# Altium project E17-07-TIU.PrjPcb
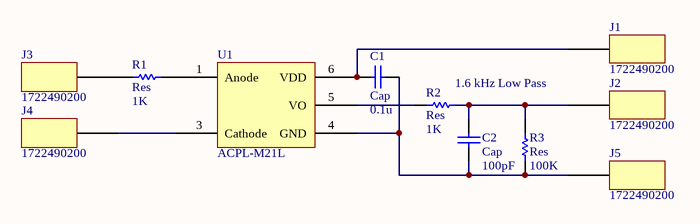
[diagram p0: E17-07-TIU.SchDoc]
1 sheet, 11 parts. Net scope: global (net labels, ports and power ports of the same name join across sheets).
Board file: E17-07-TIU.PcbDoc

## Sheet E17-07-TIU.SchDoc
size A4

### Parts
C1  Cap  value 0.1u  [C0805]
C2  Cap  value 100pF  [C0805]
J1  1722490200  [1722490200]
J2  1722490200  [1722490200]
J3  1722490200  [1722490200]
J4  1722490200  [1722490200]
J5  1722490200  [1722490200]
R1  Res  value 1K  [2012[0805]]
R2  Res  value 1K  [2012[0805]]
R3  Res  value 100K  [2012[0805]]
U1  ACPL-M21L  [ACPL-M21L]

### Nets
NetC1_1: C1.1 C2.1 J5.1 R3.1 U1.4(GND)
NetC1_2: C1.2 J1.1 U1.6(VDD)
NetC2_2: C2.2 J2.1 R2.2 R3.2
NetJ3_1: J3.1 R1.1
NetJ4_1: J4.1 U1.3(Cathode)
NetR1_2: R1.2 U1.1(Anode)
NetR2_1: R2.1 U1.5(VO)

### Notes on the sheet
- (near R2) 1.6 kHz Low Pass

### Library data of the parts
C1 C2 = Cap: Capacitor; Published: 8-Jun-2000; LatestRevisionDate: 17-Jul-2002; LatestRevisionNote: Re-released for DXP Platform.; PackageReference: C1206; Publisher: Altium Limited
R1-R3 = Res: Surface Mount Resistor; Published: 8-Jun-2000; LatestRevisionDate: 17-Jul-2002; LatestRevisionNote: Re-released for DXP Platform.; PackageReference: AXIAL-0.5; Publisher: Altium Limited